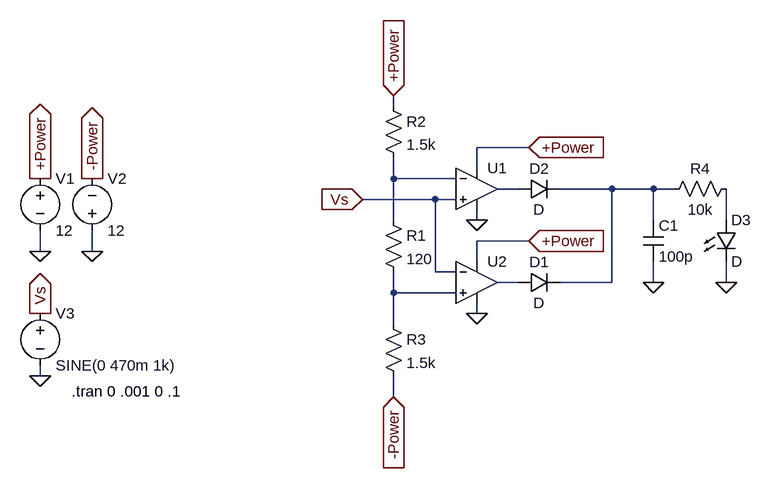
[diagram p0: schematic Peak Detector.asc]
Peak Detector.asc, the LTspice schematic file:
Version 4.1
SHEET 1 960 680
WIRE 240 64 240 48
WIRE 448 128 368 128
WIRE 368 160 368 128
WIRE 240 176 240 144
WIRE 336 176 240 176
WIRE 432 192 400 192
WIRE 576 192 496 192
WIRE 640 192 576 192
WIRE 672 192 640 192
WIRE 304 208 192 208
WIRE 336 208 304 208
WIRE 240 240 240 176
WIRE 368 240 368 224
WIRE 640 240 640 192
WIRE 752 240 752 192
WIRE 448 272 368 272
WIRE -304 288 -304 256
WIRE -224 288 -224 256
WIRE 368 304 368 272
WIRE 304 320 304 208
WIRE 336 320 304 320
WIRE 432 336 400 336
WIRE 576 336 576 192
WIRE 576 336 496 336
WIRE 640 336 640 304
WIRE 752 336 752 304
WIRE 240 352 240 320
WIRE 336 352 240 352
WIRE 368 384 368 368
WIRE 240 400 240 352
WIRE -304 480 -304 464
WIRE 240 512 240 480
FLAG 448 128 +Power
IOPIN 448 128 In
FLAG 192 208 Vs
IOPIN 192 208 In
FLAG -304 176 +Power
IOPIN -304 176 Out
FLAG -224 176 -Power
IOPIN -224 176 Out
FLAG -304 288 0
FLAG -224 288 0
FLAG -304 480 0
FLAG -304 384 Vs
IOPIN -304 384 Out
FLAG 448 272 +Power
IOPIN 448 272 In
FLAG 240 48 +Power
IOPIN 240 48 In
FLAG 240 512 -Power
IOPIN 240 512 In
FLAG 640 336 0
FLAG 752 336 0
FLAG 368 384 0
FLAG 368 240 0
SYMBOL OpAmps\\UniversalOpAmp 368 192 R0
SYMATTR InstName U1
SYMBOL voltage -304 160 R0
WINDOW 123 0 0 Left 0
WINDOW 39 0 0 Left 0
SYMATTR InstName V1
SYMATTR Value 12
SYMBOL voltage -224 272 M180
WINDOW 0 24 96 Left 2
WINDOW 3 24 16 Left 2
WINDOW 123 0 0 Left 0
WINDOW 39 0 0 Left 0
SYMATTR InstName V2
SYMATTR Value 12
SYMBOL voltage -304 368 R0
WINDOW 123 0 0 Left 0
WINDOW 39 0 0 Left 0
SYMATTR InstName V3
SYMATTR Value SINE(0 470m 1k)
SYMBOL OpAmps\\UniversalOpAmp 368 336 R0
SYMATTR InstName U2
SYMBOL res 224 224 R0
SYMATTR InstName R1
SYMATTR Value 120
SYMBOL res 224 48 R0
SYMATTR InstName R2
SYMATTR Value 1.5k
SYMBOL res 224 384 R0
SYMATTR InstName R3
SYMATTR Value 1.5k
SYMBOL diode 432 352 R270
WINDOW 0 32 32 VTop 2
WINDOW 3 0 32 VBottom 2
SYMATTR InstName D1
SYMBOL diode 432 208 R270
WINDOW 0 32 32 VTop 2
WINDOW 3 0 32 VBottom 2
SYMATTR InstName D2
SYMBOL cap 624 240 R0
SYMATTR InstName C1
SYMATTR Value 100p
SYMBOL LED 736 240 R0
SYMATTR InstName D3
SYMBOL res 768 176 R90
WINDOW 0 0 56 VBottom 2
WINDOW 3 32 56 VTop 2
SYMATTR InstName R4
SYMATTR Value 10k
TEXT -256 504 Left 2 !.tran 0 .001 0 .1

The netlist it stands for:
* Peak Detector.asc
X§U1 Vs N001 +Power 0 N002 level1 Avol=1Meg GBW=10Meg Vos=0 En=0 Enk=0 In=0 Ink=0 Rin=500Meg  ; pins In+ In- V+ V- OUT
V1 +Power 0 12
V2 0 -Power 12
V3 Vs 0 SINE(0 470m 1k)
X§U2 N006 Vs +Power 0 N005 level1 Avol=1Meg GBW=10Meg Vos=0 En=0 Enk=0 In=0 Ink=0 Rin=500Meg  ; pins In+ In- V+ V- OUT
R1 N001 N006 120
R2 +Power N001 1.5k
R3 N006 -Power 1.5k
D1 N005 N003 D
D2 N002 N003 D
C1 N003 0 100p
D3 N004 0 D
R4 N004 N003 10k
.model D D
.lib standard.dio
.tran 0 .001 0 .1
.lib UniversalOpAmp1.lib
.backanno
.end